# Altium schematic sheet [25] - LEDS, BUTTONS.SchDoc
size A2; DocumentNumber: 25; SheetNumber: 25; SheetTotal: 31
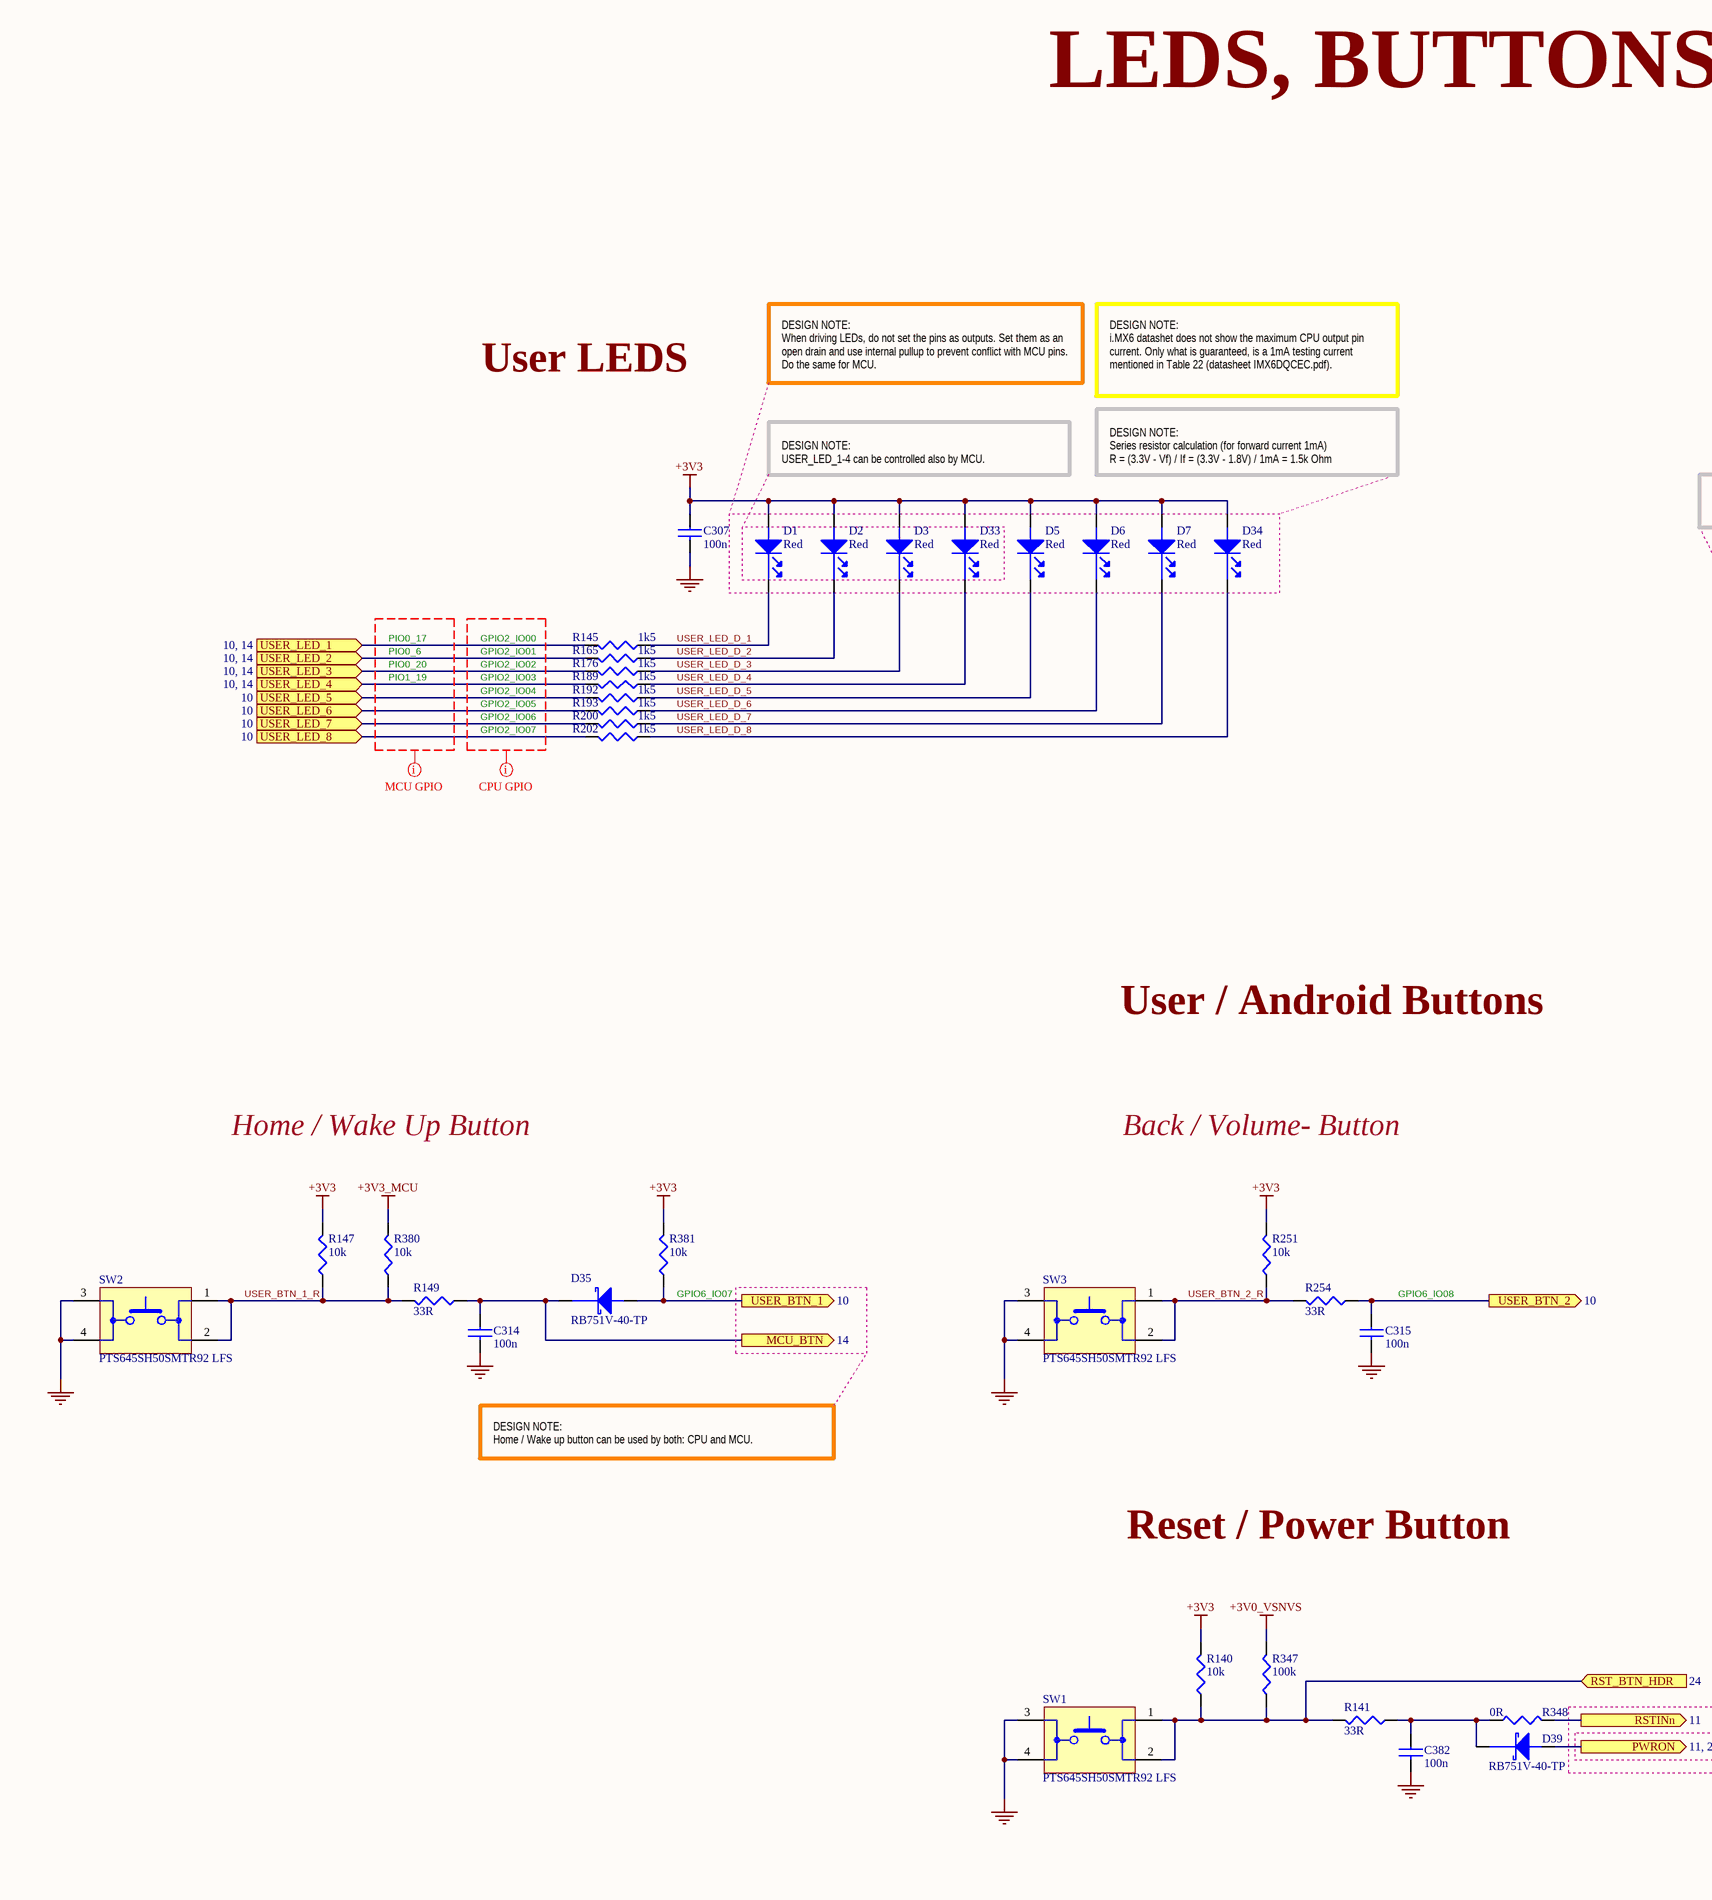
[diagram p0: [25] - LEDS, BUTTONS.SchDoc, left]
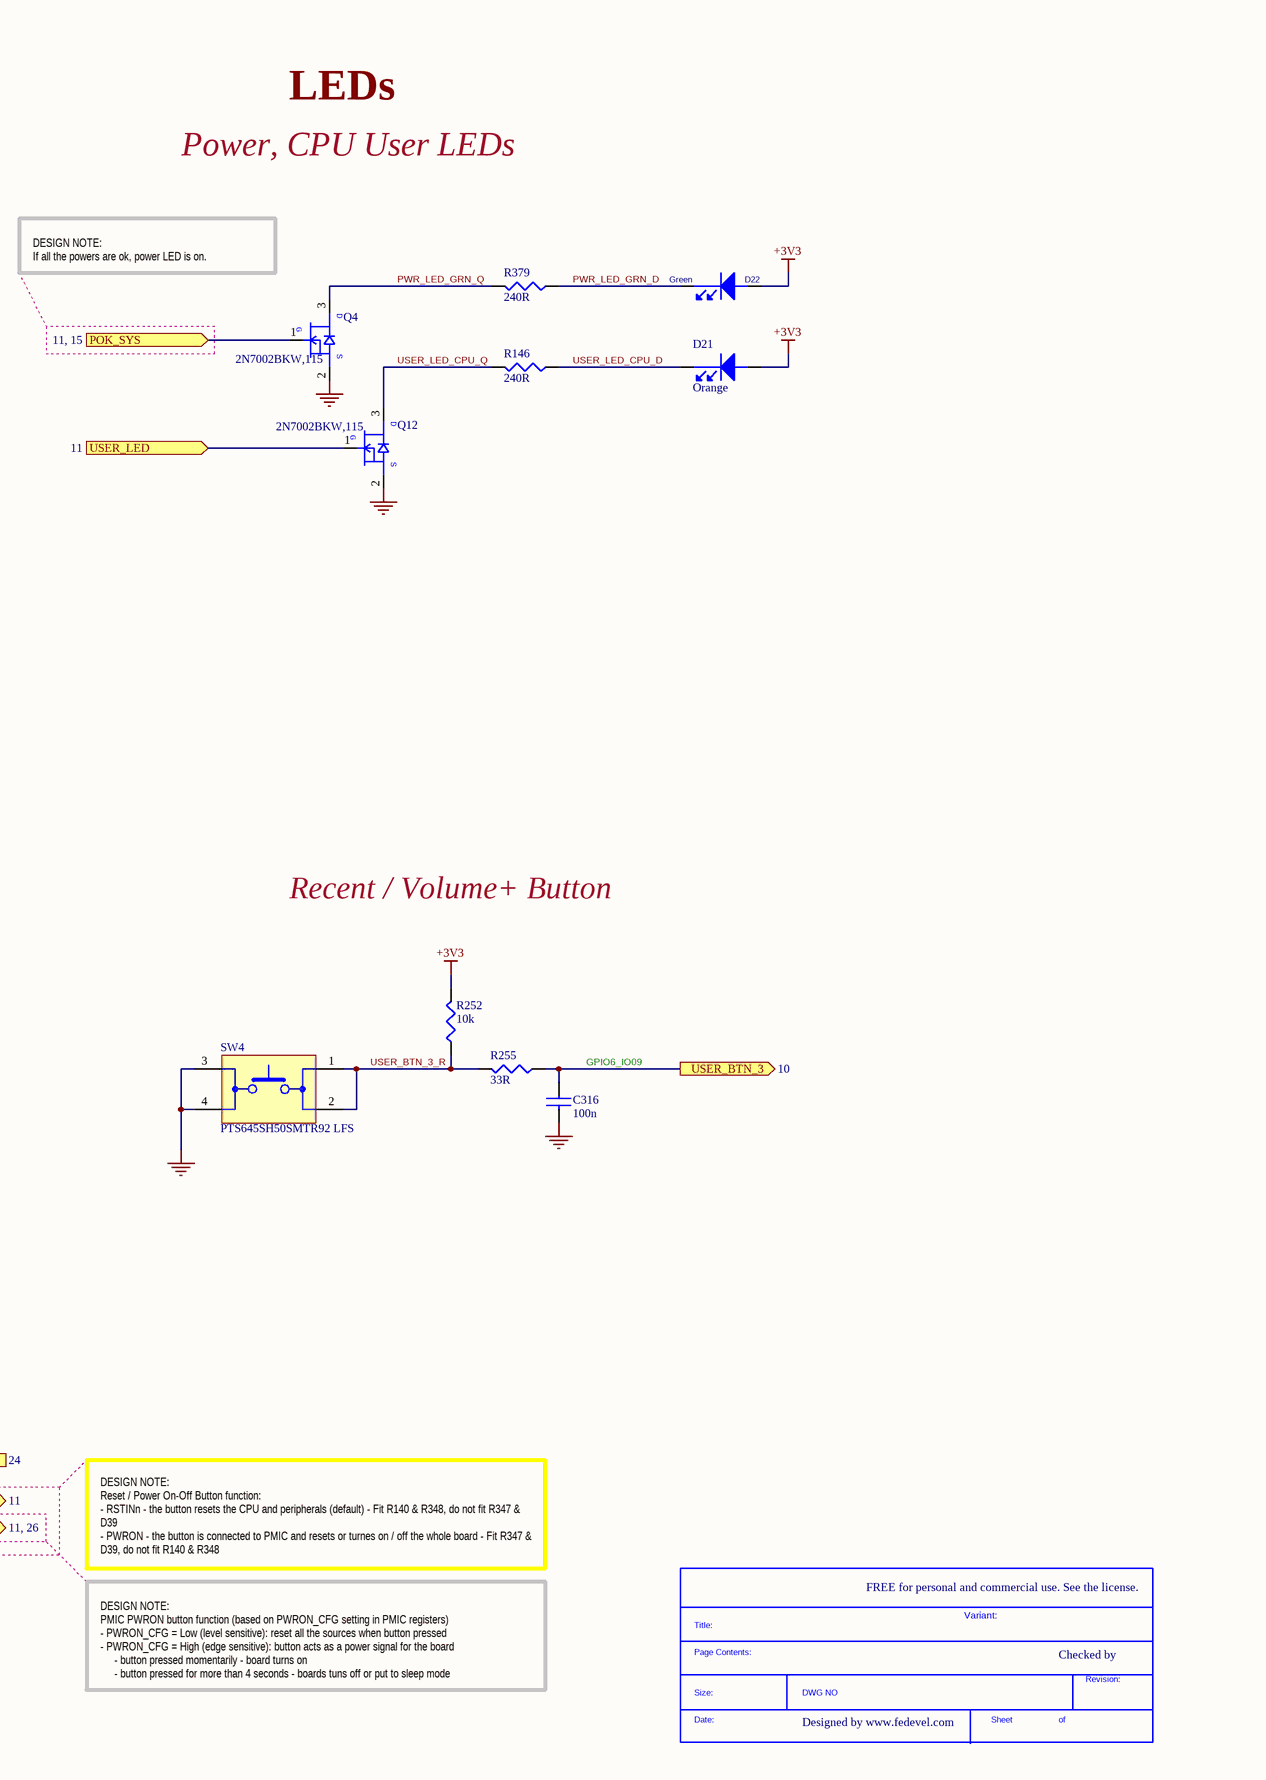
[diagram p1: [25] - LEDS, BUTTONS.SchDoc, right]

## Parts
*  SDTitleBlock  (value not drawn)  (graphical)
C307  100n  [C0402]
C314  100n  [C0402]
C315  100n  [C0402]
C316  100n  [C0402]
C382  100n  [C0402]
D1  Red  [LED_0603]
D2  Red  [LED_0603]
D3  Red  [LED_0603]
D5  Red  [LED_0603]
D6  Red  [LED_0603]
D7  Red  [LED_0603]
D21  Orange  [LED_0603]
D22  Green  [LED_0603]
D33  Red  [LED_0603]
D34  Red  [LED_0603]
D35  RB751V-40-TP  [SOD323]
D39  RB751V-40-TP  [SOD323]
Q4  2N7002BKW,115  [SC70_SOT323]
Q12  2N7002BKW,115  [SC70_SOT323]
R140  10k  [R0402]
R141  33R  [R0402]
R145  1k5  [R0402]
R146  240R  [R0402]
R147  10k  [R0402]
R149  33R  [R0402]
R165  1k5  [R0402]
R176  1k5  [R0402]
R189  1k5  [R0402]
R192  1k5  [R0402]
R193  1k5  [R0402]
R200  1k5  [R0402]
R202  1k5  [R0402]
R251  10k  [R0402]
R252  10k  [R0402]
R254  33R  [R0402]
R255  33R  [R0402]
R347  100k  [R0402]
R348  0R  [R0402]
R379  240R  [R0402]
R380  10k  [R0402]
R381  10k  [R0402]
SW1  PTS645SH50SMTR92 LFS  [TACT_SMD]
SW2  PTS645SH50SMTR92 LFS  [TACT_SMD]
SW3  PTS645SH50SMTR92 LFS  [TACT_SMD]
SW4  PTS645SH50SMTR92 LFS  [TACT_SMD]

## Ports
MCU_BTN (out, see 14), POK_SYS (see 11, 15), PWRON (out, see 11, 26), RST_BTN_HDR (in, see 24), RSTINn (out, see 11), USER_BTN_1 (out, see 10), USER_BTN_2 (out, see 10), USER_BTN_3 (out, see 10), USER_LED (in, see 11), USER_LED_1 (in, see 10, 14), USER_LED_2 (in, see 10, 14), USER_LED_3 (in, see 10, 14), USER_LED_4 (in, see 10, 14), USER_LED_5 (in, see 10), USER_LED_6 (in, see 10), USER_LED_7 (in, see 10), USER_LED_8 (in, see 10)

## Nets
+3V0_VSNVS: R347.2
+3V3: C307.1 D1.2(ANODE) D2.2(ANODE) D3.2(ANODE) D5.2(ANODE) D6.2(ANODE) D7.2(ANODE) D21.2(ANODE) D22.2(ANODE) D33.2(ANODE) D34.2(ANODE) R140.2 R147.2 R251.2 R252.2 R381.2
+3V3_MCU: R380.2
GND: C307.2 C314.2 C315.2 C316.2 C382.2 Q4.2(SOURCE) Q12.2(SOURCE) SW1.3(MECH1) SW1.4(MECH2) SW2.3(MECH1) SW2.4(MECH2) SW3.3(MECH1) SW3.4(MECH2) SW4.3(MECH1) SW4.4(MECH2)
MCU_BTN: C314.1 D35.1(cathode) R149.1 ; port MCU_BTN
POK_SYS: Q4.1(GATE) ; port POK_SYS
PWR_LED_GRN_D: D22.1(cathode) R379.1
PWR_LED_GRN_Q: Q4.3(DRAIN) R379.2
PWRON: D39.2(ANODE) ; port PWRON
RST_BTN_HDR: R140.1 R141.2 R347.1 SW1.1 SW1.2 ; port RST_BTN_HDR
RSTINn: R348.2 ; port RSTINn
USER_BTN_1: D35.2(ANODE) R381.1 ; port USER_BTN_1
USER_BTN_1_R: R147.1 R149.2 R380.1 SW2.1 SW2.2
USER_BTN_2: C315.1 R254.1 ; port USER_BTN_2
USER_BTN_2_R: R251.1 R254.2 SW3.1 SW3.2
USER_BTN_3: C316.1 R255.1 ; port USER_BTN_3
USER_BTN_3_R: R252.1 R255.2 SW4.1 SW4.2
USER_LED: Q12.1(GATE) ; port USER_LED
USER_LED_1: R145.2 ; port USER_LED_1
USER_LED_2: R165.2 ; port USER_LED_2
USER_LED_3: R176.2 ; port USER_LED_3
USER_LED_4: R189.2 ; port USER_LED_4
USER_LED_5: R192.2 ; port USER_LED_5
USER_LED_6: R193.2 ; port USER_LED_6
USER_LED_7: R200.2 ; port USER_LED_7
USER_LED_8: R202.2 ; port USER_LED_8
USER_LED_CPU_D: D21.1(cathode) R146.1
USER_LED_CPU_Q: Q12.3(DRAIN) R146.2
USER_LED_D_1: D1.1(cathode) R145.1
USER_LED_D_2: D2.1(cathode) R165.1
USER_LED_D_3: D3.1(cathode) R176.1
USER_LED_D_4: D33.1(cathode) R189.1
USER_LED_D_5: D5.1(cathode) R192.1
USER_LED_D_6: D6.1(cathode) R193.1
USER_LED_D_7: D7.1(cathode) R200.1
USER_LED_D_8: D34.1(cathode) R202.1
NetC382_1: C382.1 D39.1(cathode) R141.1 R348.1

## Layout directives
mark named CPU GPIO: (no net found under the mark)
mark named MCU GPIO: (no net found under the mark)

## Notes on the sheet
- LEDS, BUTTONS
- User LEDS
- DESIGN NOTE:
  When driving LEDs, do not set the pins as outputs. Set them as an open drain and use internal pullup to prevent conflict with MCU pins. Do the same for MCU.
- DESIGN NOTE:
  i.MX6 datashet does not show the maximum CPU output pin current. Only what is guaranteed, is a 1mA testing current mentioned in Table 22 (datasheet IMX6DQCEC.pdf).
- LEDs
- Power, CPU User LEDs
- DESIGN NOTE:
  USER_LED_1-4 can be controlled also by MCU.
- DESIGN NOTE:
  Series resistor calculation (for forward current 1mA)
  R = (3.3V - Vf) / If = (3.3V - 1.8V) / 1mA = 1.5k Ohm
- DESIGN NOTE:
  If all the powers are ok, power LED is on.
- PIO0_17
- GPIO2_IO00
- PIO1_19
- PIO0_6
- PIO0_20
- GPIO2_IO01
- GPIO2_IO02
- GPIO2_IO03
- GPIO2_IO04
- GPIO2_IO05
- GPIO2_IO06
- GPIO2_IO07
- User / Android Buttons
- Home / Wake Up Button
- Back / Volume- Button
- Recent / Volume+ Button
- (near R381) GPIO6_IO07
- GPIO6_IO08
- GPIO6_IO09
- DESIGN NOTE:
  Home / Wake up button can be used by both: CPU and MCU.
- Reset / Power Button
- DESIGN NOTE:
  Reset / Power On-Off Button function:
  - RSTINn - the button resets the CPU and peripherals (default) - Fit R140 & R348, do not fit R347 & D39
  - PWRON - the button is connected to PMIC and resets or turnes on / off the whole board - Fit R347 & D39, do not fit R140 & R348
- FREE for personal and commercial use. See the license.
- Variant:
- Checked by
- DESIGN NOTE:
  PMIC PWRON button function (based on PWRON_CFG setting in PMIC registers)
  - PWRON_CFG = Low (level sensitive): reset all the sources when button pressed
  - PWRON_CFG = High (edge sensitive): button acts as a power signal for the board
  - button pressed momentarily - board turns on
  - button pressed for more than 4 seconds - boards tuns off or put to sleep mode
- Designed by www.fedevel.com
- (in symbol 2N7002BKW,115) D; G; S
- (in symbol SDTitleBlock) Title:; Page Contents:; Revision:; Size:; DWG NO; Date:; Sheet; of

## Library data of the parts
C307 C314-C316 C382 = C1005X5R1H104K: CAP CER .10UF 50V X5R 10% 0402; Manufacturer: TDK Corporation; Capacitance: 0.1µF; Value: 100nF; .Checked PCB: used; Category: Capacitors; Supplier Part Number: 445-5942-1-ND; Manufacturer Part Number: C1005X5R1H104K; Operating Temperature: -55°C ~ 85°C; Package / Case: 0402 (1005 Metric); Price 1k [$]: 0.02340; .Checked SCH: used; Voltage - Rated: 50V; Supplier: Digikey; Supplier 1: Digi-Key; Supplier Part Number 1: 445-5942-1-ND; RoHS: RoHS Compliant; Stock 1: 106926; Pricing 1: 1=0.27, 10=0.18, 100=0.072, 250=0.05176, 500=0.0369, 1000=0.027 (USD); Tolerance: ±10%; Temperature Coefficient: X5R; Mounting Type: Surface Mount, MLCC; Applications: General Purpose; Ratings: -; Size / Dimension: 0.039" L x 0.020" W (1.00mm x 0.50mm); Height - Seated (Max): -; Thickness (Max): 0.022" (0.55mm); Lead Spacing: -; Features: -; Packaging: Cut Tape (CT); Lead Style: -; ComponentLink1URL: http://www.tdk.co.jp/tefe02/e412_c.pdf; ComponentLink1Description: http://www.tdk.co.jp/tefe02/e412_c.pdf
D1-D3 D5-D7 D33 D34 = LS L29K-H1J2-1-Z: LED SMARTLED RED 630NM 0603 SMD; Manufacturer: OSRAM Opto Semiconductors Inc; Millicandela Rating: 4.95mcd; Voltage - Forward (Vf) Typ: 1.8V; Current - Test: 2mA; Wavelength - Peak: 643nm; Viewing Angle: 160°; Lens Type: Diffused; Lens Style/Size: Rectangle with Flat Top, 1.3mm x 0.8mm; Luminous Flux @ Current - Test: 20 mlm; .Checked PCB: used; Supplier 1: Digi-Key; Supplier Part Number 1: 475-1195-1-ND; Manufacturer Part Number: LS L29K-H1J2-1-Z; RoHS: RoHS Compliant; Category: Optoelectronics; Stock 1: 71670; Pricing 1: 1=0.16, 10=0.137, 100=0.1093, 250=0.09564, 500=0.08744 (USD); Color: Red; Wavelength - Dominant: 630nm; Package / Case: 0603 (1608 Metric); Size / Dimension: 1.70mm L x 0.80mm W; Height: 0.65mm; Mounting Type: Surface Mount; Packaging: Cut Tape (CT); ComponentLink1URL: http://catalog.osram-os.com/catalogue/catalogue.do;jsessionid=DB7CFDBAC5AF1E216E45F622E867085A?act=downloadFile&favOid=020000010003f9de000100b6; ComponentLink1Description: http://catalog.osram-os.com/catalogue/catalogue.do;jsessionid=DB7CFDBAC5AF1E216E45F622E867085A?act=downloadFile&favOid=020000010003f9de000100b6; .Checked SCH: used
D21 = LO L29K-H2K1-24-Z: LED SMARTLED ORANGE 606NM 0603; Manufacturer: OSRAM Opto Semiconductors Inc; Millicandela Rating: 6.3mcd; Voltage - Forward (Vf) Typ: 1.8V; Current - Test: 2mA; Wavelength - Peak: 610nm; Viewing Angle: 160°; Lens Type: Diffused; Lens Style/Size: Rectangle with Flat Top, 1.3mm x 0.8mm; Luminous Flux @ Current - Test: 25 mlm; .Checked PCB: used; Supplier 1: Digi-Key; Supplier Part Number 1: 475-2740-1-ND; Manufacturer Part Number: LO L29K-H2K1-24-Z; RoHS: RoHS Compliant; Category: Optoelectronics; Stock 1: 15900; Pricing 1: 1=0.17, 10=0.141, 100=0.1127, 250=0.0986, 500=0.09016 (USD); Color: Orange; Wavelength - Dominant: 606nm; Package / Case: 0603 (1608 Metric); Size / Dimension: 1.70mm L x 0.80mm W; Height: 0.65mm; Mounting Type: Surface Mount; Packaging: Cut Tape (CT); ComponentLink1URL: http://catalog.osram-os.com/catalogue/catalogue.do;jsessionid=302CF83AF637AE24E40AEB0ADA267EDD?act=downloadFile&favOid=020000010003f9de000100b6; ComponentLink1Description: http://catalog.osram-os.com/catalogue/catalogue.do;jsessionid=302CF83AF637AE24E40AEB0ADA267EDD?act=downloadFile&favOid=020000010003f9de000100b6; .Checked SCH: used
D22 = LG L29K-G2J1-24-Z: LED SMARTLED GREEN 570NM 0603; Manufacturer: OSRAM Opto Semiconductors Inc; .Checked PCB: used; Current - Test: 2mA; Voltage - Forward (Vf) Typ: 1.7V; Luminous Flux @ Current - Test: 12 mlm; Millicandela Rating: 3.92mcd; Wavelength - Peak: 572nm; Lens Type: Diffused; Lens Style/Size: Rectangle with Flat Top, 1.3mm x 0.8mm; Viewing Angle: 160°; Regulator Topology: Positive Fixed; Voltage - Output: 2.5V; Voltage - Input: 2.6 V ~ 6 V; Voltage - Dropout (Typical): 0.16V @ 500mA; Number of Regulators: 1; Current - Output: 500mA; Current - Limit (Min): 600mA; .Checked SCH: used; Category: Optoelectronics; Family: LEDs - <75mA, Discre; Manufacturer Part Number: LG L29K-G2J1-24-Z; Price 1k [$]: 0.08744; Value: Green; Color: Green; Package / Case: 0603 (1608 Metric); Supplier Part Number: 475-2709-1-ND; Supplier: Digikey; Supplier 1: Digi-Key; Supplier Part Number 1: 475-2709-1-ND; RoHS: RoHS Compliant; Stock 1: 30318; Pricing 1: 1=0.16, 10=0.137, 100=0.1093, 250=0.09564, 500=0.08744 (USD); Wavelength - Dominant: 570nm; Size / Dimension: 1.70mm L x 0.80mm W; Height: 0.65mm; Mounting Type: Surface Mount; Packaging: Cut Tape (CT); ComponentLink1URL: http://catalog.osram-os.com/catalogue/catalogue.do;jsessionid=32CB61882C089EDD4B6D0A54E7E1F117?act=downloadFile&favOid=020000020000138e000100b6; ComponentLink1Description: http://catalog.osram-os.com/catalogue/catalogue.do;jsessionid=32CB61882C089EDD4B6D0A54E7E1F117?act=downloadFile&favOid=020000020000138e000100b6; Operating Temperature: -40°C ~ 125°C; Supplier Device Package: 6-TMLF® (1.6x1.6); ComponentLink2URL: http://www.micrel.com/_PDF/mic5353.pdf; ComponentLink2Description: http://www.micrel.com/_PDF/mic5353.pdf
D35 D39 = RB751V-40-TP: DIODE SCHTKY 30MA 30V SOD-323; Manufacturer: Micro Commercial Co; Diode Type: Schottky; Voltage - Forward (Vf) (Max) @ If: 370mV @ 1mA; Speed: Small Signal =< 200mA (Io), Any Speed; Current - Reverse Leakage @ Vr: 500nA @ 30V; Capacitance @ Vr, F: 2pF @ 1V, 1MHz; .Checked PCB: used; Supplier 1: Digi-Key; Supplier Part Number 1: RB751V-40-TPMSCT-ND; Manufacturer Part Number: RB751V-40-TP; RoHS: RoHS Compliant; Category: Discrete Semiconductor Products; Stock 1: 18964; Pricing 1: 1=0.48, 10=0.342, 100=0.2014, 250=0.14252, 500=0.1216, 1000=0.095 (USD); Voltage - DC Reverse (Vr) (Max): 30V; Current - Average Rectified (Io): 30mA; Reverse Recovery Time (trr): -; Mounting Type: Surface Mount; Package / Case: SC-76, SOD-323; Supplier Device Package: SOD-323; Packaging: Cut Tape (CT); ComponentLink1URL: http://61.222.192.61/mccsemi/up_pdf/RB751V-40(SOD-323).PDF; ComponentLink1Description: http://61.222.192.61/mccsemi/up_pdf/RB751V-40(SOD-323).PDF; .Checked SCH: used
Q4 Q12 = 2N7002BKW,115: MOSFET N-CH 60V 310MA SOT323; Manufacturer: NXP Semiconductors; FET Type: MOSFET N-Channel, Metal Oxide; FET Feature: Logic Level Gate; Rds On (Max) @ Id, Vgs: 1.6 Ohm @ 500mA, 10V; Vgs(th) (Max) @ Id: 2.1V @ 250µA; Gate Charge (Qg) @ Vgs: 0.6nC @ 4.5V; Input Capacitance (Ciss) @ Vds: 50pF @ 10V; Power - Max: 275mW; .Checked PCB: used; Supplier 1: Digi-Key; Supplier Part Number 1: 568-5980-1-ND; Manufacturer Part Number: 2N7002BKW,115; RoHS: RoHS Compliant; Category: Discrete Semiconductor Products; Stock 1: 15666; Pricing 1: 1=0.39, 10=0.354, 25=0.2548, 100=0.1983, 250=0.12456, 500=0.10616, 1000=0.07233 (USD); Drain to Source Voltage (Vdss): 60V; Current - Continuous Drain (Id) @ 25° C: 310mA; Mounting Type: Surface Mount; Package / Case: SC-70, SOT-323; Supplier Device Package: SC-70; Packaging: Cut Tape (CT); ComponentLink1URL: http://www.nxp.com/documents/data_sheet/2N7002BKW.pdf; ComponentLink1Description: http://www.nxp.com/documents/data_sheet/2N7002BKW.pdf; .Checked SCH: used
R140 R147 R251 R252 R380 R381 = RC0402FR-0710KL: RES 10.0K OHM 1/16W 1% 0402 SMD; Manufacturer: Yageo; Power (Watts): 0.063W, 1/16W; .Checked PCB: used; Temperature Coefficient: ±100ppm/°C; Category: Resistors; Supplier Part Number: 311-10.0KLRCT-ND; Manufacturer Part Number: RC0402FR-0710KL; Package / Case: 0402 (1005 Metric); Price 1k [$]: 0.01421; Resistance (Ohms): 10K; Tolerance: ±1%; Value: 10k; .Checked SCH: used; Supplier: Digikey; Supplier 1: Digi-Key; Supplier Part Number 1: 311-10.0KLRCT-ND; RoHS: RoHS Compliant; Stock 1: 2916495; Pricing 1: 10=0.014, 50=0.0104, 100=0.0079, 250=0.00584, 500=0.00432, 1000=0.00288 (USD); Composition: Thick Film; Features: -; Size / Dimension: 0.039" L x 0.020" W (1.00mm x 0.50mm); Height: 0.016" (0.40mm); Number of Terminations: 2; Packaging: Cut Tape (CT); ComponentLink1URL: http://www.yageo.com/documents/recent/PYu-RC0402_51_RoHS_L_6.pdf; ComponentLink1Description: http://www.yageo.com/documents/recent/PYu-RC0402_51_RoHS_L_6.pdf
R141 R149 R254 R255 = RMCF0402FT33R0: RES TF 33 OHM 1% 1/16W 0402; Manufacturer: Stackpole Electronics Inc; Resistance (Ohms): 33; Power (Watts): 0.063W, 1/16W; .Checked PCB: used; Temperature Coefficient: ±100ppm/°C; Category: Resistors; Supplier Part Number: RMCF0402FT33R0CT-ND; Manufacturer Part Number: RMCF0402FT33R0; Package / Case: 0402 (1005 Metric); Price 1k [$]: 0.00384; Tolerance: ±1%; Value: 33R; .Checked SCH: used; Supplier: Digikey; Supplier 1: Digi-Key; Supplier Part Number 1: RMCF0402FT33R0CT-ND; RoHS: RoHS Compliant; Stock 1: 26866; Pricing 1: 1=0.04, 10=0.025, 50=0.0138, 100=0.0105, 250=0.0078, 500=0.00576, 1000=0.00384 (USD); Composition: Thick Film; Features: -; Size / Dimension: 0.039" L x 0.020" W (1.00mm x 0.50mm); Height: 0.016" (0.40mm); Number of Terminations: 2; Packaging: Cut Tape (CT); ComponentLink1URL: http://www.seielect.com/Catalog/SEI-RMCF.pdf; ComponentLink1Description: http://www.seielect.com/Catalog/SEI-RMCF.pdf
R145 R165 R176 R189 R192 R193 R200 R202 = RC0402FR-071K5L: RES 1.50K OHM 1/16W 1% 0402 SMD; Manufacturer: Yageo; Resistance (Ohms): 1.5k; Power (Watts): 0.063W, 1/16W; Temperature Coefficient: ±100ppm/°C; .Creator: MM; Supplier 1: Digi-Key; Manufacturer Part Number: RC0402FR-071K5L; RoHS: RoHS Compliant; Category: Resistors; Stock 1: 499348; Pricing 1: 1=0.1, 10=0.014, 25=0.0104, 100=0.0063, 250=0.0054, 500=0.00382, 1000=0.0027, 2500=0.00234, 5000=0.00203 (USD); Packaging: Cut Tape (CT); Tolerance: ±1%; Composition: Thick Film; Features: -; Package / Case: 0402 (1005 Metric); Supplier Device Package: 0402; Size / Dimension: 0.039" L x 0.020" W (1.00mm x 0.50mm); Height: 0.016" (0.40mm); Number of Terminations: 2; ComponentLink1URL: http://www.yageo.com/documents/recent/PYu-RC0402_51_RoHS_L_6.pdf; ComponentLink1Description: http://www.yageo.com/documents/recent/PYu-RC0402_51_RoHS_L_6.pdf; Supplier Part Number 1: 311-1.50KLRCT-ND; .Checked PCB: MM; .Checked SCH: MM
R146 R379 = RMCF0402FT240R: RES TF 240 OHM 1% 0.0625W 0402; Manufacturer: Stackpole Electronics Inc; Resistance (Ohms): 240; Power (Watts): 0.063W, 1/16W; .Checked PCB: used; Temperature Coefficient: ±100ppm/°C; Category: Resistors; Supplier Part Number: RMCF0402FT240RCT-ND; Manufacturer Part Number: RMCF0402FT240R; Package / Case: 0402 (1005 Metric); Price 1k [$]: 0.00384; Tolerance: ±1%; Value: 240R; .Checked SCH: used; Supplier: Digikey; Supplier 1: Digi-Key; Supplier Part Number 1: RMCF0402FT240RCT-ND; RoHS: RoHS Compliant; Stock 1: 39860; Pricing 1: 1=0.04, 10=0.025, 50=0.0138, 100=0.0105, 250=0.0078, 500=0.00576, 1000=0.00384 (USD); Composition: Thick Film; Features: -; Size / Dimension: 0.039" L x 0.020" W (1.00mm x 0.50mm); Height: 0.016" (0.40mm); Number of Terminations: 2; Packaging: Cut Tape (CT); ComponentLink1URL: http://www.seielect.com/Catalog/SEI-RMCF.pdf; ComponentLink1Description: http://www.seielect.com/Catalog/SEI-RMCF.pdf
R347 = RMCF0402FT100K: RES 100K OHM 1/16W 1% 0402 SMD; Manufacturer: Stackpole Electronics Inc; Power (Watts): 0.063W, 1/16W; .Checked PCB: used; Temperature Coefficient: ±100ppm/°C; Category: Resistors; Supplier Part Number: RMCF0402FT100KCT-ND; Manufacturer Part Number: RMCF0402FT100K; Package / Case: 0402 (1005 Metric); Price 1k [$]: 0.00384; Resistance (Ohms): 100K; Tolerance: ±1%; Value: 100k; .Checked SCH: used; Supplier: Digikey; Supplier 1: Digi-Key; Supplier Part Number 1: RMCF0402FT100KCT-ND; RoHS: RoHS Compliant; Stock 1: 95; Pricing 1: 1=0.04, 10=0.025, 50=0.0138, 100=0.0105, 250=0.0078, 500=0.00576, 1000=0.00384 (USD); Composition: Thick Film; Features: -; Size / Dimension: 0.039" L x 0.020" W (1.00mm x 0.50mm); Height: 0.016" (0.40mm); Number of Terminations: 2; Packaging: Cut Tape (CT); ComponentLink1URL: http://www.seielect.com/Catalog/SEI-RMCF.pdf; ComponentLink1Description: http://www.seielect.com/Catalog/SEI-RMCF.pdf
R348 = RC0402JR-070RL: RES 0.0 OHM 1/16W 0402 SMD; Manufacturer: Yageo; Resistance (Ohms): 0.0; Power (Watts): 0.063W, 1/16W; Tolerance: Jumper; .Checked PCB: used; Category: Resistors; Supplier Part Number: 311-0.0JRCT-ND; Manufacturer Part Number: RC0402JR-070RL; Package / Case: 0402 (1005 Metric); Price 1k [$]: 0.01389; Value: 0R; .Checked SCH: used; Supplier: Digikey; Supplier 1: Digi-Key; Supplier Part Number 1: 311-0.0JRCT-ND; RoHS: RoHS Compliant; Stock 1: 1106330; Pricing 1: 10=0.012, 50=0.009, 100=0.0069, 250=0.00512, 500=0.0038, 1000=0.00253 (USD); Composition: Thick Film; Features: -; Temperature Coefficient: -; Size / Dimension: 0.039" L x 0.020" W (1.00mm x 0.50mm); Height: 0.016" (0.40mm); Number of Terminations: 2; Packaging: Cut Tape (CT); ComponentLink1URL: http://www.yageo.com/documents/recent/PYu-RC0402_51_RoHS_L_6.pdf; ComponentLink1Description: http://www.yageo.com/documents/recent/PYu-RC0402_51_RoHS_L_6.pdf
SW1-SW4 = PTS645SH50SMTR92 LFS: SWITCH TACTILE SPST-NO 0.05A 12V; Manufacturer: C&K Components; Switch Function: Off-Mom; Contact Rating @ Voltage: 0.05A @ 12VDC; Actuator Type: Standard; Actuator Height off PCB, from Pins: 5.00mm; Actuator Orientation: Top Actuated; Outline: 6.00mm x 6.00mm; Illumination: Non-Illuminated; Operating Force: 200gf; Actuator Material: Polyamide (PA66), Nylon 6/6; Mechanical Life: 100,000 Cycles; .Checked PCB: MM; Supplier 1: Digi-Key; Manufacturer Part Number: PTS645SH50SMTR92 LFS; RoHS: RoHS Compliant; Category: Switches; Stock 1: 61129; Pricing 1: 1=0.29, 10=0.281, 25=0.2712, 50=0.2614, 100=0.2468, 250=0.23232, 500=0.22264 (USD); Packaging: Cut Tape (CT); Circuit: SPST-NO; Mounting Type: Surface Mount; Termination Style: Gull Wing; Illumination Voltage (Nominal): -; Illumination Type, Color: -; Ingress Protection: -; Features: -; Switch Travel: -; Operating Temperature: -20°C ~ 60°C; ComponentLink1URL: http://www.ck-components.com/14409/pts645_25apr13.pdf/; ComponentLink1Description: http://www.ck-components.com/14409/pts645_25apr13.pdf/; Supplier Part Number 1: CKN9085CT-ND; .Checked SCH: MM; .Creator: MM